# EAGLE board BLDC_controller_0 (EAGLE 9.4.1), part 1 of 2
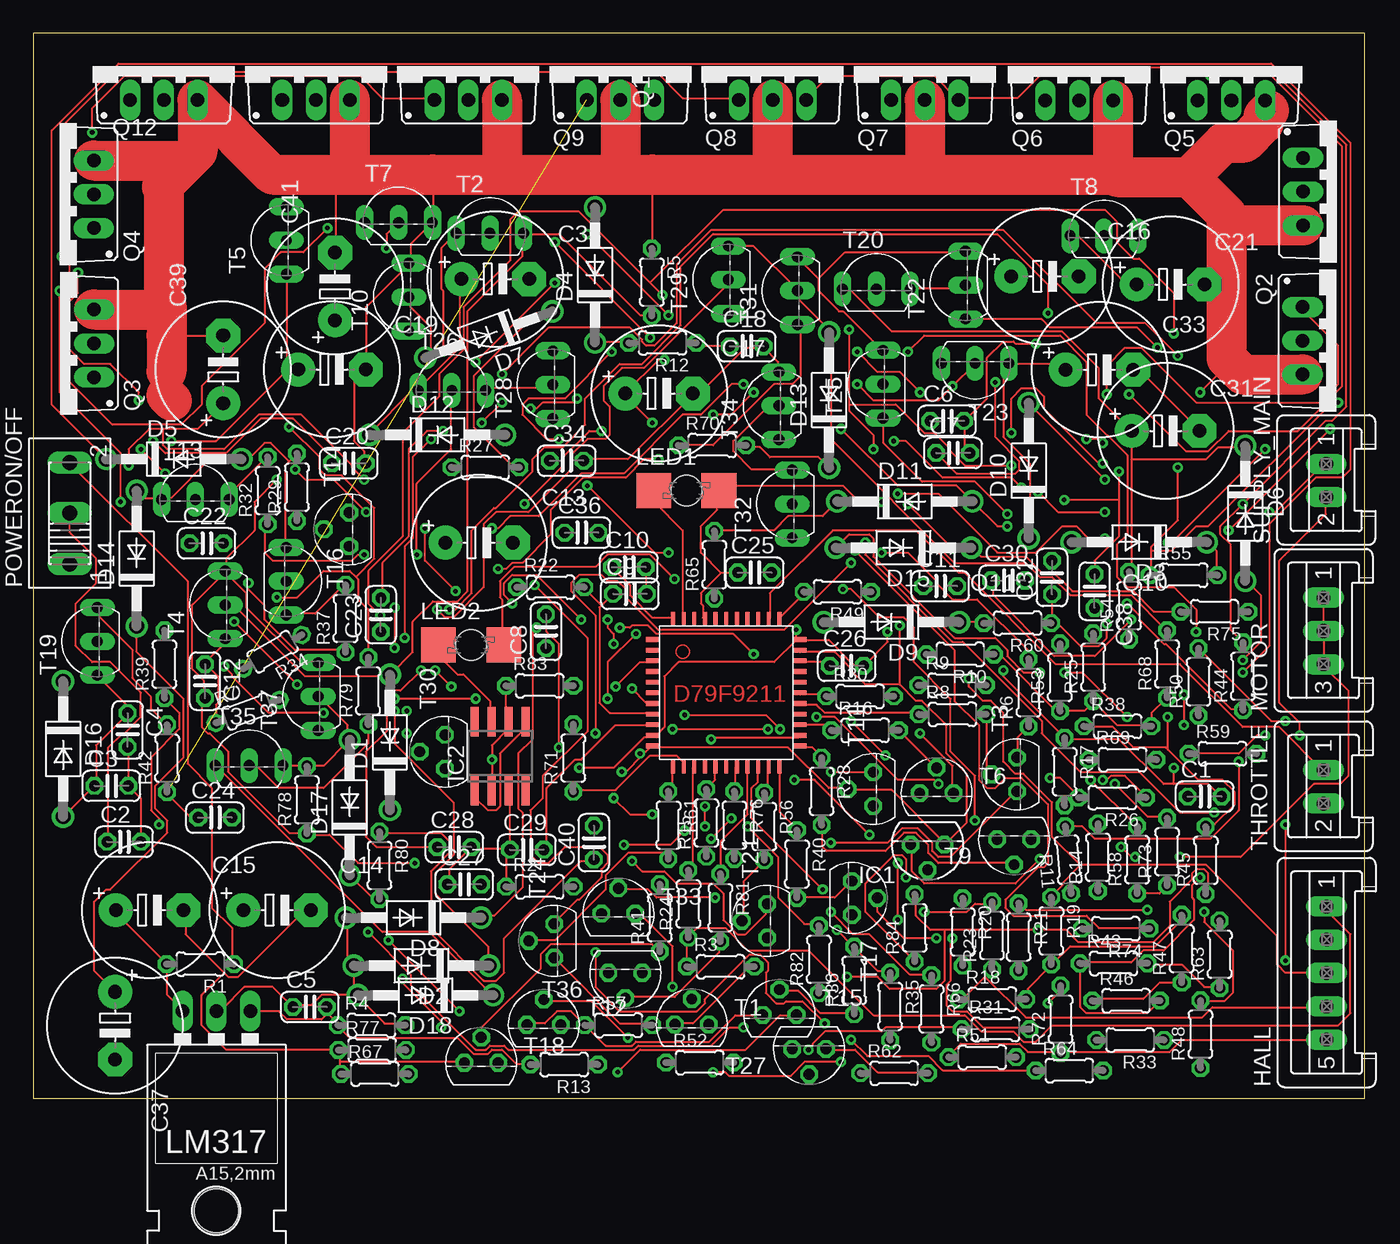
[diagram p3: board, top side]
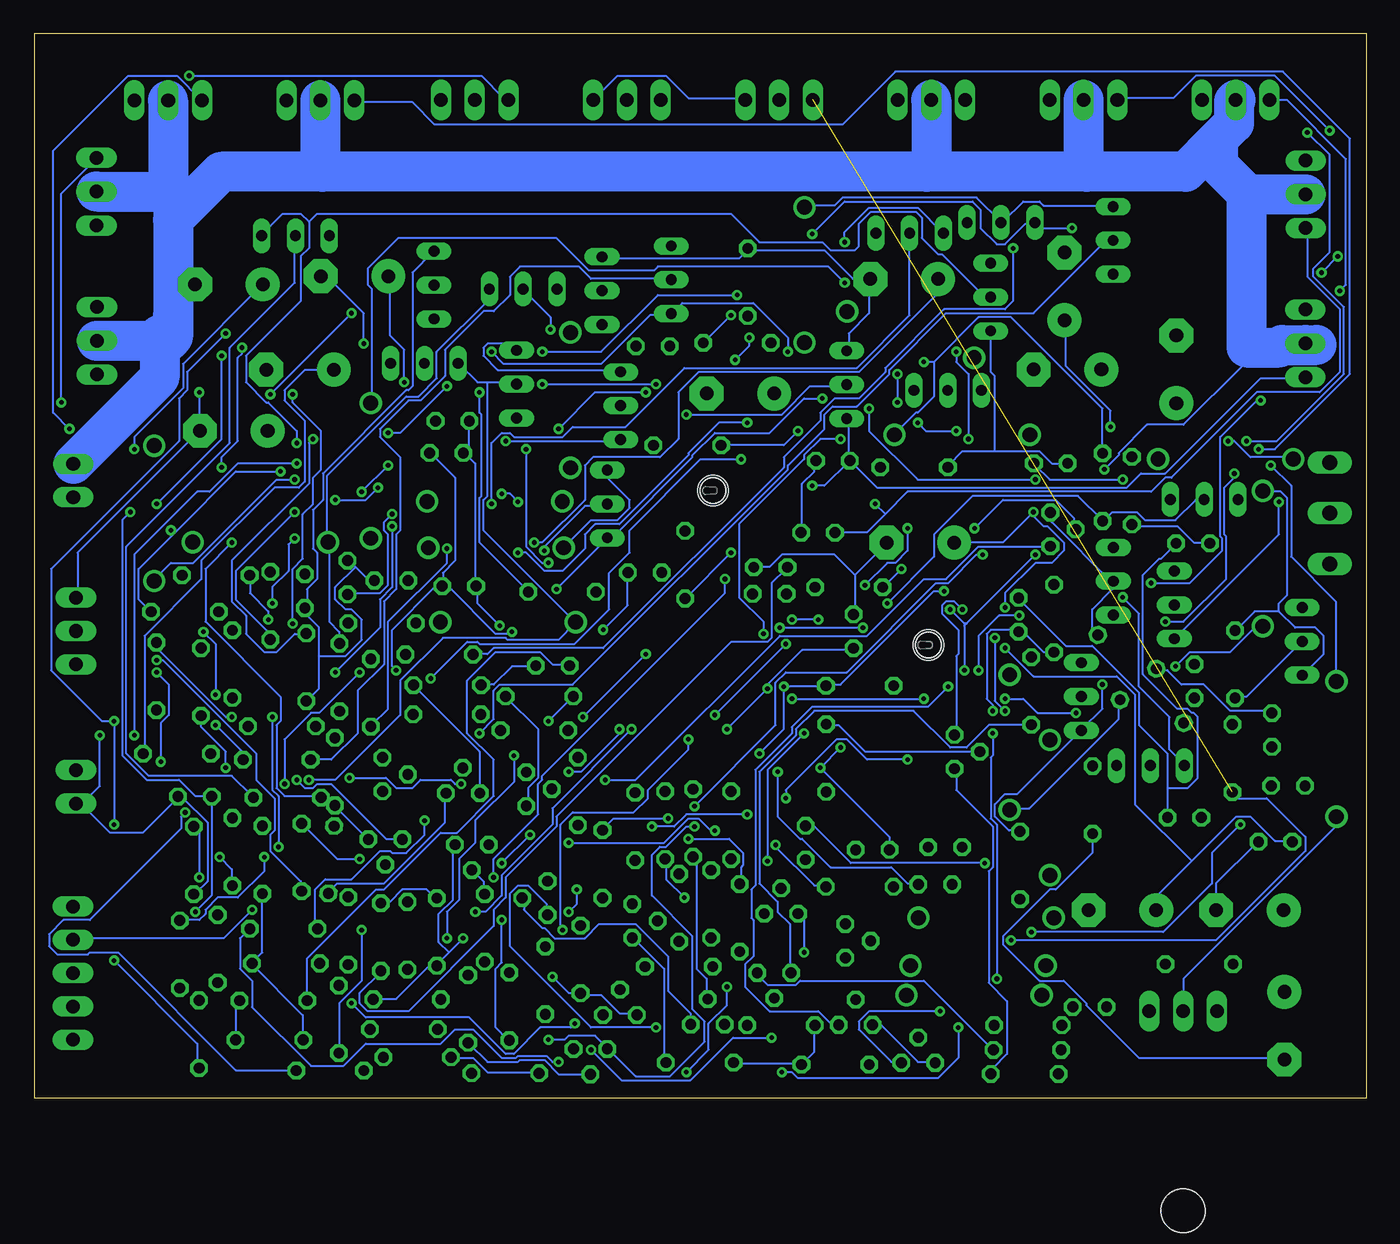
[diagram p4: board, bottom side, seen from below]

Size 100 x 80 mm. Coordinates in mm from the lower left corner, seen from the top.
Outline: 0,0 100,0 100,80 0,80 0,0
Copper layers (1*16): Top 0.035mm / dielectric 1.5mm / Bottom 0.035mm
Design rules "default": minimum track width 6mil, minimum drill 0.35mm, track to track 6mil, track to pad 6mil, pad to pad 6mil, via to via 6mil, smd to smd 6mil, copper to edge 40mil, drill to drill 6mil, minimum pad ring 10mil, minimum via ring 8mil, stop-mask expansion 4mil, vias tented up to drill 0mil, thermal gap 10mil

## Footprints (pad centres in the part's own frame; a part is rotated, then mirrored left to right if it is on the bottom)
C025-024X044 = drill 0.813 octagon: 1 -1.27,0; 2 1.27,0
E5-10,5 = drill 1.016 pad 2.54: + -2.54,0 | drill 1.016 pad 2.54 octagon: - 2.54,0
DO41-10 = drill 1.118: A 5.08,0; C -5.08,0
S05P = drill 1.016 long: 1 5,0; 2 2.5,0; 3 0,0; 4 -2.5,0; 5 -5,0
TO92 = drill 0.813 octagon: 1 -1.27,0; 2 0,1.905; 3 1.27,0
SO08 = smd 0.6 x 2.2: 1 -1.905,-2.6; 2 -0.635,-2.6; 3 0.635,-2.6; 4 1.905,-2.6; 5 1.905,2.6; 6 0.635,2.6; 7 -0.635,2.6; 8 -1.905,2.6
P47F-BOTTOM = smd 2.6 x 2.6: A -2.45,0; C 2.45,0 | hole 2.3: 0,0
317TL = drill 1.016 long: 1 -2.54,-3.81; 2 0,-3.81; 3 2.54,-3.81 | hole 3.302: 0,11.176
S03P = drill 1.016 long: 1 2.5,0; 2 0,0; 3 -2.5,0
255SB = drill 1.118 long: 1 -3.81,0; 2 0,0; 3 3.81,0
TO220BV = drill 1.016 long: D 0,-2.54; G -2.54,-2.54; S 2.54,-2.54
0204/5 = drill 0.813 octagon: 1 -2.54,0; 2 2.54,0
S02P = drill 1.016 long: 1 1.25,0; 2 -1.25,0
TO92' = drill 0.813 octagon: 1 1.27,0; 2 0,1.905; 3 -1.27,0
TO92-EBC = drill 0.813 long: B 0,-1.27; C 2.54,-1.27; E -2.54,-1.27
D79F9211 = smd 0.35 x 1: B0 1,-0.56; B1 1.8,-0.56; B2 2.6,-0.56; B3 3.4,-0.56; B4 4.2,-0.56; B5 5,-0.56; B6 5.8,-0.56; B7 6.6,-0.56; B8 7.4,-0.56; B9 8.2,-0.56; B10 9,-0.56; T0 1,10.56; T1 1.8,10.56; T2 2.6,10.56; T3 3.4,10.56; T4 4.2,10.56; T5 5,10.56; T6 5.8,10.56; T7 6.6,10.56; T8 7.4,10.56; T9 8.2,10.56; T10 9,10.56 | smd 1 x 0.35: L0 -0.56,9; L1 -0.56,8.2; L2 -0.56,7.4; L3 -0.56,6.6; L4 -0.56,5.8; L5 -0.56,5; L6 -0.56,4.2; L7 -0.56,3.4; L8 -0.56,2.6; L9 -0.56,1.8; L10 -0.56,1; R0 10.56,9; R1 10.56,8.2; R2 10.56,7.4; R3 10.56,6.6; R4 10.56,5.8; R5 10.56,5; R6 10.56,4.2; R7 10.56,3.4; R8 10.56,2.6; R9 10.56,1.8; R10 10.56,1

## Placement (x,y rotation side)
C1  100nF  [C025-024X044]  87.97,22.68 0 top
C2  100nF  [C025-024X044]  6.82,19.28 0 top
C3  100nF  [C025-024X044]  5.87,23.48 0 top
C4  100nF  [C025-024X044]  7.08,27.68 270 top
C5  100nF  [C025-024X044]  20.77,6.88 0 top
C6  100nF  [C025-024X044]  68.62,50.88 0 top
C7  100nF  [C025-024X044]  69.07,48.48 0 top
C8  10nF  [C025-024X044]  38.5,35.09 90 top
C9  10nF  [C025-024X044]  44.81,37.9 0 top
C10  10nF  [C025-024X044]  44.73,39.9 0 top
C11  100nF  [C025-024X044]  68.12,38.48 0 top
C12  10nF  [C025-024X044]  12.9,31.35 270 top
C13  470uF  [E5-10,5]  33.48,41.75 0 top
C14  100uF  [E5-10,5]  18.31,14.15 0 top
C15  47uF  [E5-10,5]  8.74,14.15 0 top
C16  220uF  [E5-10,5]  75.97,61.75 0 top
C17  47uF  [E5-10,5]  47,52.95 0 top
C18  10nF  [C025-024X044]  53.57,56.5 0 top
C19  47uF  [E5-10,5]  22.43,54.75 0 top
C20  10nF  [C025-024X044]  23.69,47.7 0 top
C21  47uF  [E5-10,5]  85.41,61.14 0 top
C22  10nF  [C025-024X044]  13.01,41.7 0 top
C23  10nF  [C025-024X044]  26.1,36.33 90 top
C24  10nF  [C025-024X044]  13.65,21.1 0 top
C25  10nF  [C025-024X044]  54.17,39.5 0 top
C26  10nF  [C025-024X044]  61.09,32.5 0 top
C27  100nF  [C025-024X044]  32.37,16.08 0 top
C28  100nF  [C025-024X044]  31.62,18.88 0 top
C29  100nF  [C025-024X044]  37.07,18.68 0 top
C30  10nF  [C025-024X044]  73.21,38.9 0 top
C31  47uF  [E5-10,5]  85.04,50.14 0 top
C32  10nF  [C025-024X044]  76.5,39.13 90 top
C33  47uF  [E5-10,5]  80.07,54.74 0 top
C34  10nF  [C025-024X044]  40.05,47.9 0 top
C35  47uF  [E5-10,5]  34.7,61.54 0 top
C36  10nF  [C025-024X044]  41.17,42.5 0 top
C37  47uF  [E5-10,5]  6.14,5.47 270 top
C38  10nF  [C025-024X044]  79.7,38.11 270 top
C39  47uF  [E5-10,5]  14.26,54.76 90 top
C40  10nF  [C025-024X044]  42.1,19.21 90 top
C41  47uF  [E5-10,5]  22.66,60.99 90 top
D1  1N4004  [DO41-10]  26.78,26.75 90 top
D2  1N4004  [DO41-10]  29.15,9.98 180 top
D3  1N4004  [DO41-10]  83.05,41.78 180 top
D4  1N4004  [DO41-10]  42.18,61.85 90 top
D5  1N4004  [DO41-10]  10.55,48.02 0 top
D6  1N4004  [DO41-10]  91.02,43.95 270 top
D7  1N4004  [DO41-10]  34.21,57.37 200 top
D8  1N4004  [DO41-10]  28.55,13.58 180 top
D9  1N4004  [DO41-10]  64.45,35.78 180 top
D10  1N4004  [DO41-10]  74.76,47.15 90 top
D11  1N4004  [DO41-10]  65.45,44.84 0 top
D12  1N4004  [DO41-10]  30.35,49.84 0 top
D13  1N4004  [DO41-10]  59.76,52.45 90 top
D14  1N4004  [DO41-10]  7.76,40.55 90 top
D15  1N4004  [DO41-10]  65.35,41.36 180 top
D16  1N4004  [DO41-10]  2.24,26.25 270 top
D17  1N4004  [DO41-10]  23.76,21.85 90 top
D18  1N4004  [DO41-10]  29.45,7.76 180 top
HALL  [S05P]  97.13,9.42 90 top
IC1  78L05Z  [TO92]  67.16,19.07 180 top
IC2  LM393D  [SO08]  35.05,25.7 0 top
LED1  LAP4-BOTTOM  [P47F-BOTTOM]  49.05,45.66 0 top
LED2  LAP4-BOTTOM  [P47F-BOTTOM]  32.88,34.06 0 top
LM317  [317TL]  13.75,2.75 180 top
MOTOR  [S03P]  96.9,35.11 90 top
POWERON/OFF  [255SB]  2.74,43.96 90 top
Q1  IRF540  [TO220BV]  97.89,68.11 270 top
Q2  IRF540  [TO220BV]  97.86,56.91 270 top
Q3  IRF540  [TO220BV]  2.03,56.71 90 top
Q4  IRF540  [TO220BV]  2,67.91 90 top
Q5  IRF540  [TO220BV]  89.97,77.51 0 top
Q6  IRF540  [TO220BV]  78.54,77.51 0 top
Q7  IRF540  [TO220BV]  66.95,77.54 0 top
Q8  IRF540  [TO220BV]  55.52,77.54 0 top
Q9  IRF540  [TO220BV]  44.09,77.54 0 top
Q10  IRF540  [TO220BV]  32.66,77.54 0 top
Q11  IRF540  [TO220BV]  21.23,77.54 0 top
Q12  IRF540  [TO220BV]  9.8,77.54 0 top
R1  180E  [0204/5]  12.54,10.1 180 top
R2  2.2k  [0204/5]  38.04,15.9 0 top
R3  50E  [0204/5]  51.62,9.9 0 top
R4  5.6k  [0204/5]  25.4,5.5 0 top
R5  2.2k  [0204/5]  46.45,61.31 270 top
R6  510E  [0204/5]  74.75,30.47 90 top
R7  100E  [0204/5]  16.1,29.08 20 top
R8  202k  [0204/5]  69.03,28.85 0 top
R9  2.2k  [0204/5]  69.01,31.05 0 top
R10  2.2k  [0204/5]  69.61,33.35 180 top
R11  510E  [0204/5]  77.72,17.93 95 top
R12  100E  [0204/5]  47.25,56.75 180 top
R13  47k  [0204/5]  39.87,2.55 180 top
R14  100E  [0204/5]  79.95,18.11 90 top
R15  5.6k  [0204/5]  50.55,20.69 90 top
R16  202k  [0204/5]  62.47,27.65 0 top
R17  2.2k  [0204/5]  77.45,24.55 270 top
R18  2.2k  [0204/5]  72.03,7.45 0 top
R19  2.2k  [0204/5]  76.45,12.59 270 top
R20  2.2k  [0204/5]  69.8,12.51 270 top
R21  3.3k  [0204/5]  74,12.13 270 top
R22  3.3k  [0204/5]  38.85,38.4 0 top
R23  3.3k  [0204/5]  72,12.23 90 top
R24  2.2k  [0204/5]  49.2,14.61 90 top
R25  2.2k  [0204/5]  79.6,32.39 90 top
R26  510E  [0204/5]  81.03,22.6 180 top
R27  100E  [0204/5]  33.95,47.4 0 top
R28  202k  [0204/5]  59.2,23.07 270 top
R29  510E  [0204/5]  19.8,45.91 90 top
R30  2.2k  [0204/5]  62.09,30.2 0 top
R31  2.2k  [0204/5]  72.27,5.2 0 top
R32  100E  [0204/5]  17.6,45.65 90 top
R33  10k  [0204/5]  82.37,4.4 180 top
R34  510E  [0204/5]  17.96,33.55 210 top
R35  2.2k  [0204/5]  64.35,6.91 270 top
R36  2.2k  [0204/5]  61.65,8.87 90 top
R37  100E  [0204/5]  23.45,36.05 90 top
R38  10k  [0204/5]  81.43,27.95 0 top
R39  510E  [0204/5]  9.85,32.61 90 top
R40  2.2k  [0204/5]  57.35,17.61 270 top
R41  2.2k  [0204/5]  47.05,13.57 90 top
R42  100E  [0204/5]  10.05,25.55 90 top
R43  10k  [0204/5]  81.13,10.15 0 top
R44  2.2k  [0204/5]  90.85,31.71 90 top
R45  2.2k  [0204/5]  88.05,17.89 90 top
R46  2.2k  [0204/5]  82.07,7.35 0 top
R47  2.2k  [0204/5]  86.25,11.25 90 top
R48  9.4k  [0204/5]  87.65,4.83 90 top
R49  2.2k  [0204/5]  60.39,38.05 180 top
R50  1.2k  [0204/5]  87.5,31.29 90 top
R51  220E  [0204/5]  71.27,3.1 0 top
R52  2.2k  [0204/5]  50.05,2.7 0 top
R53  2.2k  [0204/5]  77.1,31.63 90 top
R54  510E  [0204/5]  82.3,37.01 90 top
R55  100E  [0204/5]  86.39,39.3 0 top
R56  202k  [0204/5]  54.9,20.43 270 top
R57  2.2k  [0204/5]  43.95,5.5 0 top
R58  2.2k  [0204/5]  82.9,17.93 90 top
R59  510E  [0204/5]  89.31,25.9 0 top
R60  100E  [0204/5]  73.91,35.7 180 top
R61  202k  [0204/5]  47.7,20.53 270 top
R62  2.2k  [0204/5]  64.65,1.9 0 top
R63  2.2k  [0204/5]  89.1,10.83 90 top
R64  510E  [0204/5]  77.81,2.1 0 top
R65  100E  [0204/5]  51.15,40.09 90 top
R66  202k  [0204/5]  67.45,6.73 270 top
R67  2.2k  [0204/5]  25.65,1.85 0 top
R68  2.2k  [0204/5]  85.15,32.63 90 top
R69  510E  [0204/5]  81.81,25.45 0 top
R70  100E  [0204/5]  50.99,49.05 0 top
R71  202k  [0204/5]  40.55,25.57 90 top
R72  2.2k  [0204/5]  77.15,5.95 90 top
R73  2.2k  [0204/5]  85.15,18.53 90 top
R74  510E  [0204/5]  81.29,12.75 180 top
R75  100E  [0204/5]  88.71,36.55 180 top
R76  202k  [0204/5]  52.65,20.53 270 top
R77  2.2k  [0204/5]  25.45,3.65 0 top
R78  2.2k  [0204/5]  20.55,22.43 90 top
R79  510E  [0204/5]  25.15,30.61 90 top
R80  100E  [0204/5]  26,17.51 270 top
R81  202k  [0204/5]  51.6,14.33 270 top
R82  2.2k  [0204/5]  59,10.45 90 top
R83  2.2k  [0204/5]  38.03,31 0 top
R84  3.3k  [0204/5]  66.2,12.81 90 top
SUPPLY_MAIN  [S02P]  97.1,46.41 90 top
T1  [TO92']  49.45,5.56 0 top
T2  [TO92-EBC]  34.29,66.26 0 top
T3  2N3904  [TO92']  73.87,24.34 90 top
T4  [TO92-EBC]  13.14,37.07 90 top
T5  [TO92-EBC]  17.74,64.45 90 top
T6  2N3904  [TO92']  67.84,22.93 0 top
T7  [TO92-EBC]  27.43,67.06 0 top
T8  [TO92-EBC]  80.41,66.06 0 top
T9  2N3904  [TO92']  73.66,19.47 180 top
T10  [TO92-EBC]  26.94,60.19 90 top
T11  2N3904  [TO92']  63.07,23.24 90 top
T12  2N3904  [TO92']  38.34,5.53 0 top
T13  [TO92-EBC]  12.17,46.26 0 top
T14  2N3904  [TO92']  23.72,42.74 90 top
T15  2N3904  [TO92']  56.04,6.28 0 top
T16  [TO92-EBC]  20.26,38.85 270 top
T17  2N3904  [TO92']  61.48,15.06 270 top
T18  2N3904  [TO92']  33.64,2.68 0 top
T19  [TO92-EBC]  3.54,34.33 90 top
T20  [TO92-EBC]  63.31,62.06 0 top
T21  2N3904  [TO92']  55.12,13.34 90 top
T22  [TO92-EBC]  68.74,61.09 90 top
T23  [TO92-EBC]  70.73,53.94 180 top
T24  2N3904  [TO92']  39.12,11.84 90 top
T25  [TO92-EBC]  62.54,53.65 90 top
T26  [TO92-EBC]  31.43,54.46 0 top
T27  2N3904  [TO92']  58.26,3.72 180 top
T28  [TO92-EBC]  37.74,53.61 90 top
T29  [TO92-EBC]  50.92,61.49 90 top
T30  2N3904  [TO92']  30.92,26.04 90 top
T31  [TO92-EBC]  56.12,60.67 90 top
T32  [TO92-EBC]  55.72,44.65 90 top
T33  2N3904  [TO92']  43.94,13.88 0 top
T34  [TO92-EBC]  54.72,52.03 90 top
T35  [TO92-EBC]  16.21,26.28 0 top
T36  2N3904  [TO92']  44.46,9.44 180 top
T37  [TO92-EBC]  20.12,30.19 90 top
THROTTLE  [S02P]  96.9,23.41 90 top
U$1  D79F9211DF9F9211  [D79F9211]  47.04,25.47 0 top